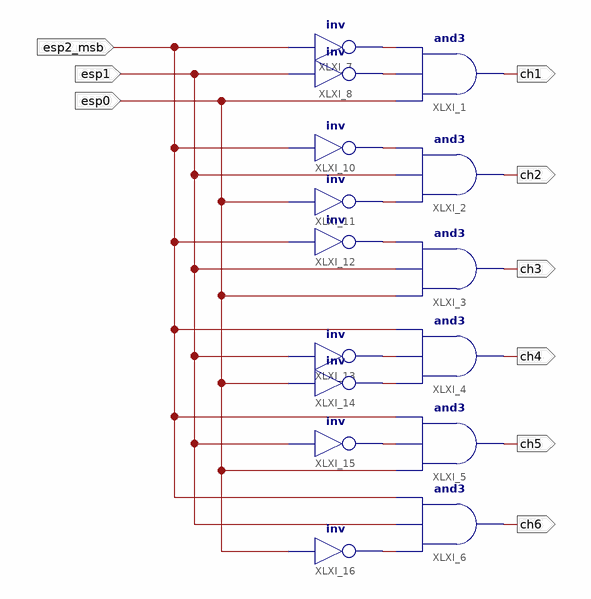
[diagram p0: schematic sheet 1]
// Xilinx ISE schematic choose.sch (spartan6) as structural Verilog: 15 symbols, 9 ports
module choose (
  input  esp2_msb,
  input  esp1,
  input  esp0,
  output ch1,
  output ch2,
  output ch3,
  output ch4,
  output ch5,
  output ch6
);

  wire XLXN_1, XLXN_2, XLXN_3, XLXN_4, XLXN_5, XLXN_6, XLXN_7, XLXN_8, XLXN_9;

  and XLXI_1 (ch1, esp0, XLXN_2, XLXN_1);
  and XLXI_2 (ch2, XLXN_4, esp1, XLXN_3);
  and XLXI_3 (ch3, esp0, esp1, XLXN_5);
  and XLXI_4 (ch4, XLXN_7, XLXN_6, esp2_msb);
  and XLXI_5 (ch5, esp0, XLXN_8, esp2_msb);
  and XLXI_6 (ch6, XLXN_9, esp1, esp2_msb);
  not XLXI_7 (XLXN_1, esp2_msb);
  not XLXI_8 (XLXN_2, esp1);
  not XLXI_10 (XLXN_3, esp2_msb);
  not XLXI_11 (XLXN_4, esp0);
  not XLXI_12 (XLXN_5, esp2_msb);
  not XLXI_13 (XLXN_6, esp1);
  not XLXI_14 (XLXN_7, esp0);
  not XLXI_15 (XLXN_8, esp1);
  not XLXI_16 (XLXN_9, esp0);
endmodule
